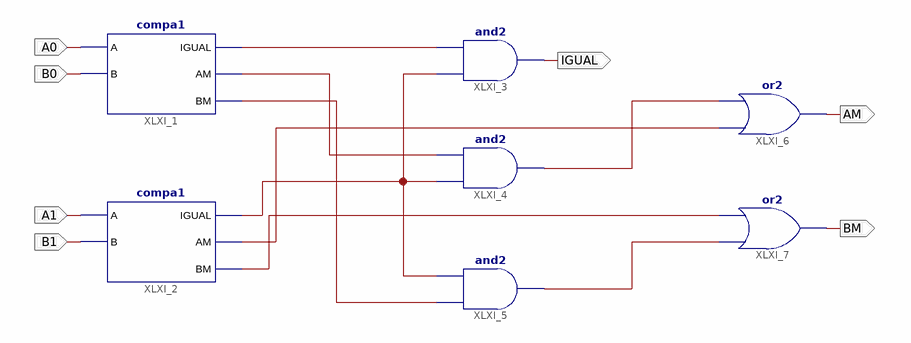
[diagram p0: schematic sheet 1]
// Xilinx ISE schematic COMPA2.sch (spartan3e) as structural Verilog: 7 symbols, 7 ports
module COMPA2 (
  input  A0,
  input  B0,
  input  A1,
  input  B1,
  output AM,
  output BM,
  output IGUAL
);

  wire XLXN_8, XLXN_9, XLXN_10, XLXN_11, XLXN_13, XLXN_14, XLXN_15, XLXN_17;

  compa1 XLXI_1 (.A(A0), .AM(XLXN_15), .B(B0), .BM(XLXN_13), .IGUAL(XLXN_14));
  compa1 XLXI_2 (.A(A1), .AM(XLXN_11), .B(B1), .BM(XLXN_10), .IGUAL(XLXN_17));
  and XLXI_3 (IGUAL, XLXN_17, XLXN_14);
  and XLXI_4 (XLXN_8, XLXN_17, XLXN_15);
  and XLXI_5 (XLXN_9, XLXN_13, XLXN_17);
  or XLXI_6 (AM, XLXN_11, XLXN_8);
  or XLXI_7 (BM, XLXN_9, XLXN_10);
endmodule
